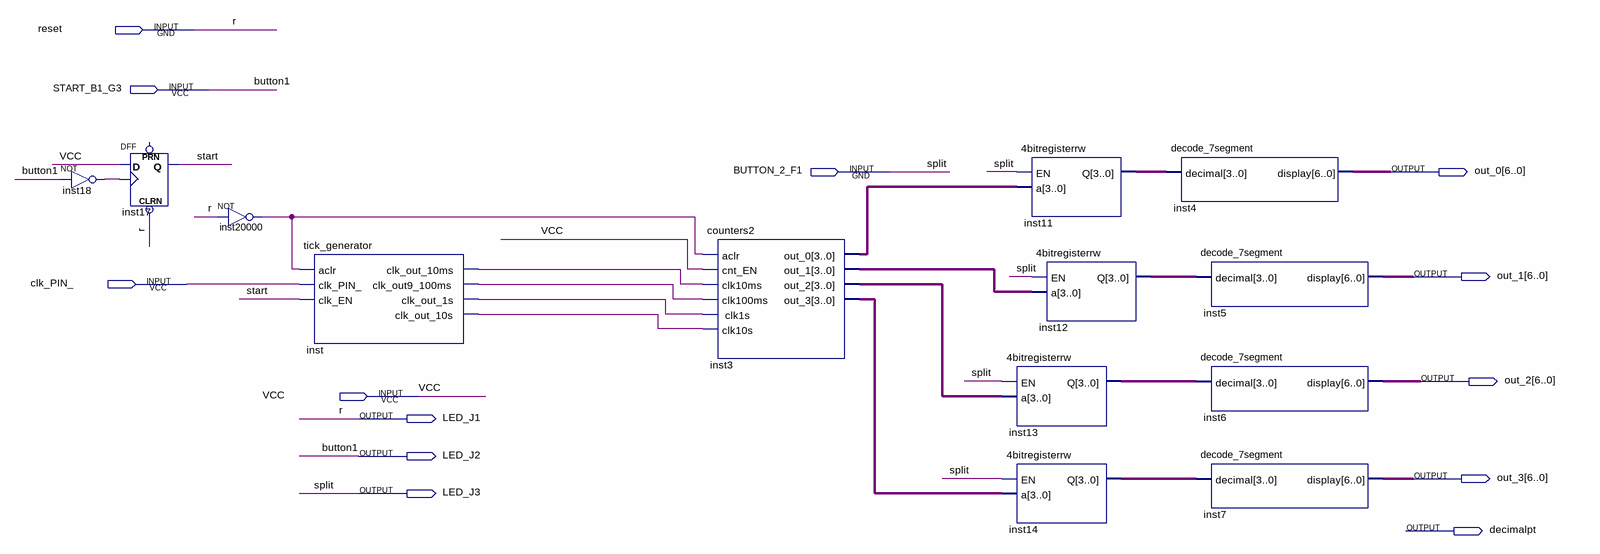
[diagram p0: schematic sheet]
// Quartus schematic stopwatch.bdf as structural Verilog: 13 symbols, 13 pins
module stopwatch (
  input  reset,
  input  START_B1_G3,
  input  BUTTON_2_F1,
  input  clk_PIN_,
  input  VCC,
  output [6:0] out_0,
  output [6:0] out_1,
  output [6:0] out_2,
  output LED_J1,
  output LED_J2,
  output [6:0] out_3,
  output LED_J3,
  output decimalpt
);

  wire inst18_out, inst20000_out, inst_clk_out9_100ms, inst_clk_out_1s, inst_clk_out_10ms, inst_clk_out_10s,
       start;
  wire [3:0] inst3_out_0, inst3_out_1, inst3_out_2, inst3_out_3, inst11_q, inst12_q, inst13_q, inst14_q;

  not inst18 (inst18_out, START_B1_G3);
  DFF inst17 (.CLRN(reset), .CLK(inst18_out), .D(VCC), .Q(start));  // open: PRN
  not inst20000 (inst20000_out, reset);
  tick_generator inst (
    .aclr(inst20000_out), .clk_PIN_(clk_PIN_), .clk_EN(start), .clk_out_10ms(inst_clk_out_10ms),
    .clk_out9_100ms(inst_clk_out9_100ms), .clk_out_1s(inst_clk_out_1s), .clk_out_10s(inst_clk_out_10s));
  counters2 inst3 (
    .aclr(inst20000_out), .cnt_EN(VCC), .clk10ms(inst_clk_out_10ms), .clk100ms(inst_clk_out9_100ms),
    .clk1s(inst_clk_out_1s), .clk10s(inst_clk_out_10s), .out_0(inst3_out_0), .out_1(inst3_out_1),
    .out_2(inst3_out_2), .out_3(inst3_out_3));
  \4bitregisterrw  inst11 (.EN(BUTTON_2_F1), .a(inst3_out_0), .Q(inst11_q));
  \4bitregisterrw  inst13 (.EN(BUTTON_2_F1), .a(inst3_out_2), .Q(inst13_q));
  \4bitregisterrw  inst14 (.EN(BUTTON_2_F1), .a(inst3_out_3), .Q(inst14_q));
  \4bitregisterrw  inst12 (.EN(BUTTON_2_F1), .a(inst3_out_1), .Q(inst12_q));
  decode_7segment inst4 (.decimal(inst11_q), .display(out_0));
  decode_7segment inst5 (.decimal(inst12_q), .display(out_1));
  decode_7segment inst6 (.decimal(inst13_q), .display(out_2));
  decode_7segment inst7 (.decimal(inst14_q), .display(out_3));

  assign LED_J1 = reset;
  assign LED_J2 = START_B1_G3;
  assign LED_J3 = BUTTON_2_F1;

  // Other names for the same wires on the sheet: button1 = START_B1_G3; r = reset; split = BUTTON_2_F1
endmodule
